# EAGLE design 01 (EAGLE 8.3.2)
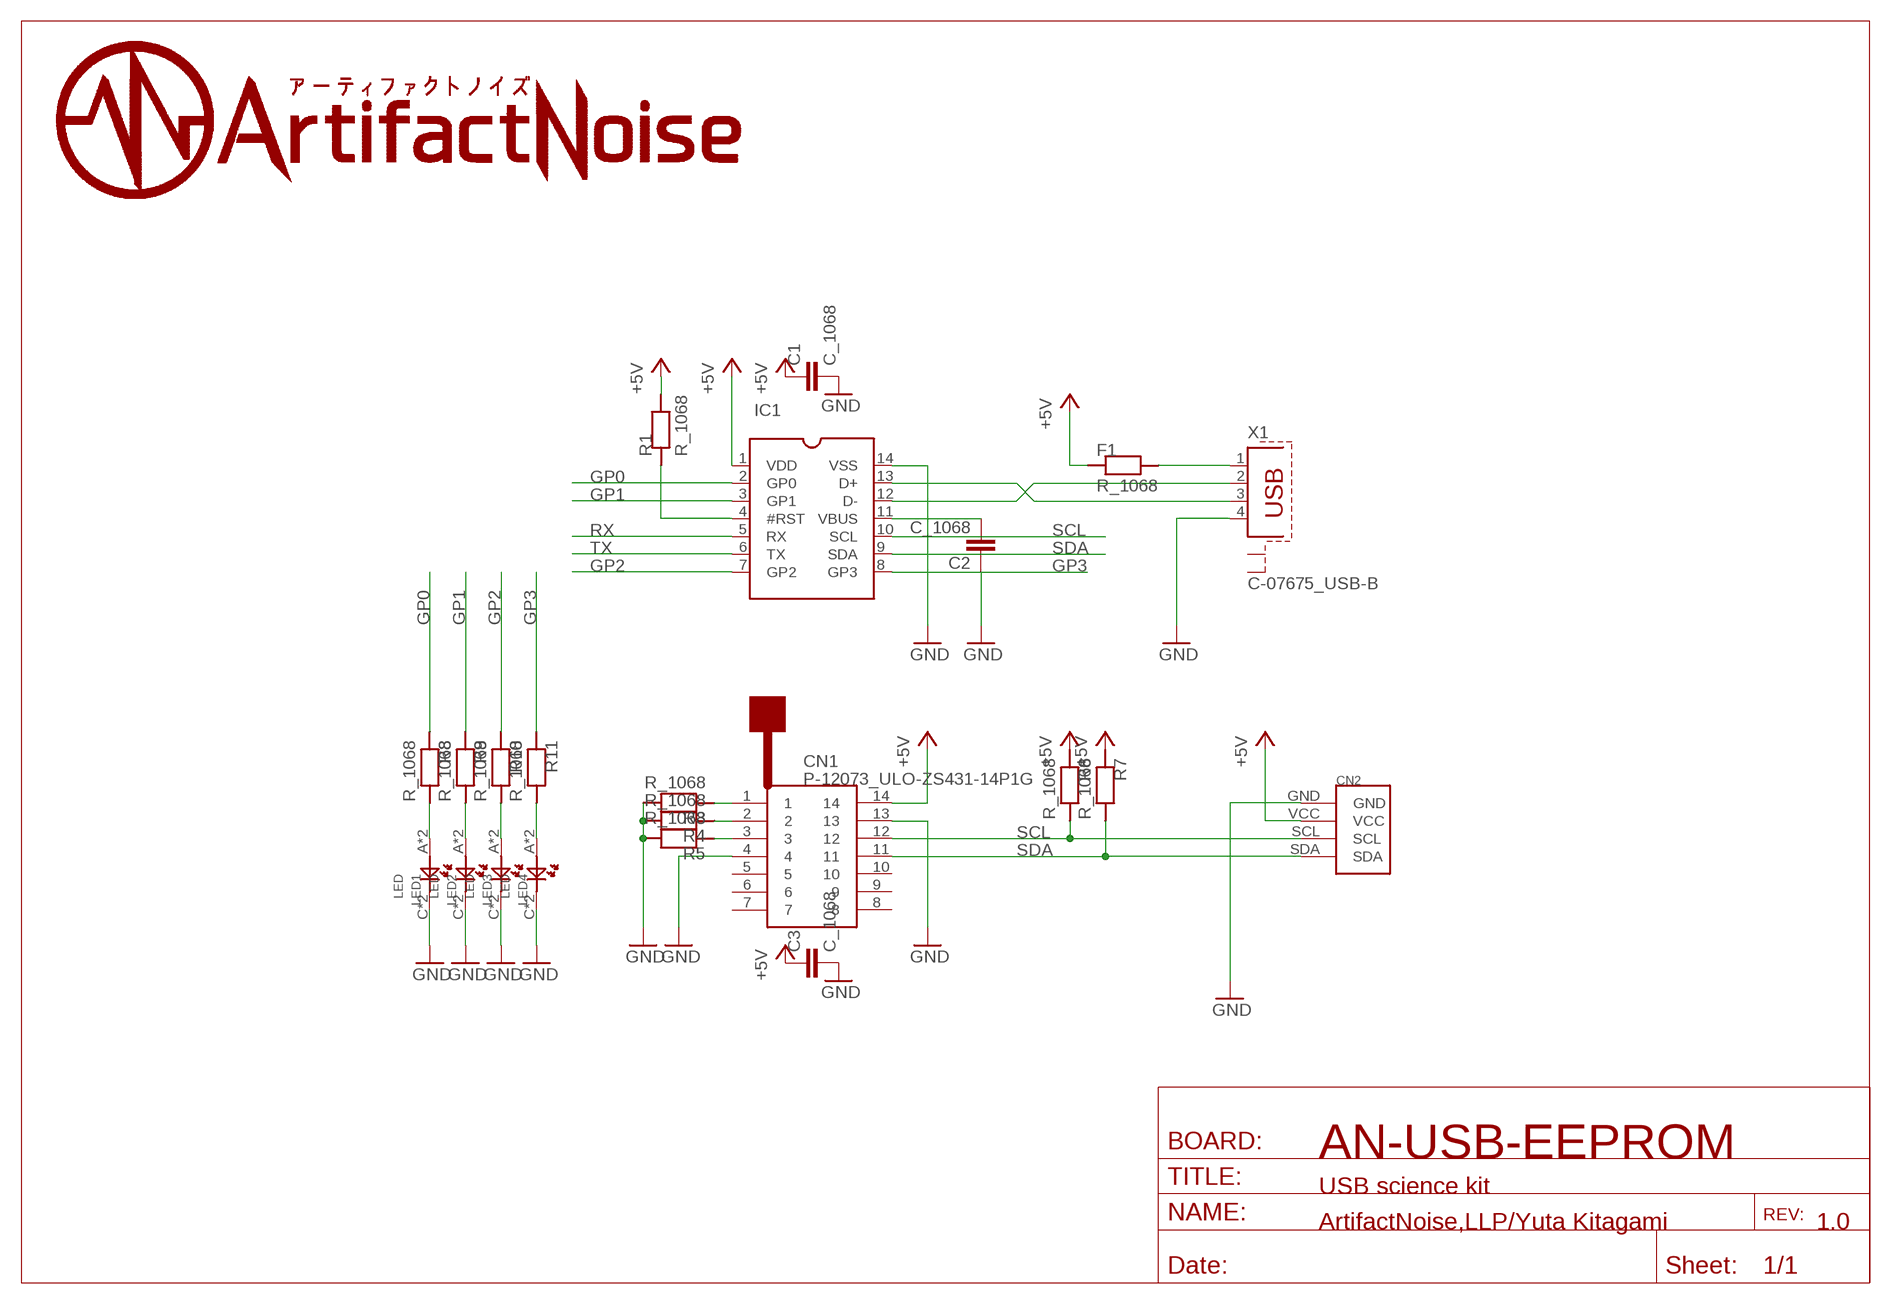
[diagram p0: schematic, sheet 1]

## Parts
C1  C_1068  [C0603]
C2  C_1068  [C0603]
C3  C_1068  [C0603]
CN1  P-12073_ULO-ZS431-14P1G  [ULO-ZS431-14P1G]
CN2  PIN4  [PIN4]
F1  R_1068  [R0603]
IC1  _MCP2221A-I/PS  [SOCKET-14]
LED1  LED  [CHIPLED_0805]
LED2  LED  [CHIPLED_0805]
LED3  LED  [CHIPLED_0805]
LED4  LED  [CHIPLED_0805]
R1  R_1068  [R0603]
R3  R_1068  [R0603]
R4  R_1068  [R0603]
R5  R_1068  [R0603]
R6  R_1068  [R0603]
R7  R_1068  [R0603]
R8  R_1068  [R0603]
R9  R_1068  [R0603]
R10  R_1068  [R0603]
R11  R_1068  [R0603]
X1  C-07675_USB-B  [PN61729-S]

## Nets
+5V: C1.1 C1.D1 C3.1 C3.D1 CN1.14 CN2.VCC F1.1 F1.D1 IC1.1(VDD) R1.2 R1.D2 R6.1 R6.D1 R7.1 R7.D1
GND: C1.2 C1.D2 C2.1 C2.D1 C3.2 C3.D2 CN1.4 CN1.13 CN2.GND IC1.14(VSS) LED1.C LED1.DC(C) LED2.C LED2.DC(C) LED3.C LED3.DC(C) LED4.C LED4.DC(C) R3.2 R3.D2 R4.2 R4.D2 R5.2 R5.D2 X1.4
GP0: IC1.2(GP0) R8.1 R8.D1
GP1: IC1.3(GP1) R9.1 R9.D1
GP2: IC1.7(GP2) R10.1 R10.D1
GP3: IC1.8(GP3) R11.1 R11.D1
N$1: IC1.4(#RST) R1.1 R1.D1
N$2: IC1.13(D+) X1.3
N$3: IC1.12(D-) X1.2
N$4: C2.2 C2.D2 IC1.11(VBUS)
N$5: F1.2 F1.D2 X1.1
N$6: CN1.1 R3.1 R3.D1
N$7: CN1.2 R4.1 R4.D1
N$8: CN1.3 R5.1 R5.D1
N$9: LED1.A LED1.DA(A) R8.2 R8.D2
N$10: LED2.A LED2.DA(A) R9.2 R9.D2
N$11: LED3.A LED3.DA(A) R10.2 R10.D2
N$12: LED4.A LED4.DA(A) R11.2 R11.D2
RX: IC1.5(RX)
SCL: CN1.12 CN2.SCL IC1.10(SCL) R6.2 R6.D2
SDA: CN1.11 CN2.SDA IC1.9(SDA) R7.2 R7.D2
TX: IC1.6(TX)
Unconnected: CN1.5 CN1.6 CN1.7 CN1.8 CN1.9 CN1.10 X1.S1 X1.S2

## Notes on the sheet
- AN-USB-EEPROM
- USB science kit
- ArtifactNoise,LLP/Yuta Kitagami | 1.0

## Library data of the parts
C1-C3 = 01:C_1068
CN1 = 01:P-12073_ULO-ZS431-14P1G
CN2 = 01:PIN4
F1 R1 R3-R11 = 01:R_1068
IC1 = 01:_MCP2221A-I/P: Dual In Line / Socket
LED1-LED4 = 01:LED
X1 = 01:C-07675_USB-B: BERG USB connector; OC_FARNELL: unknown; OC_NEWARK: unknown

## Board
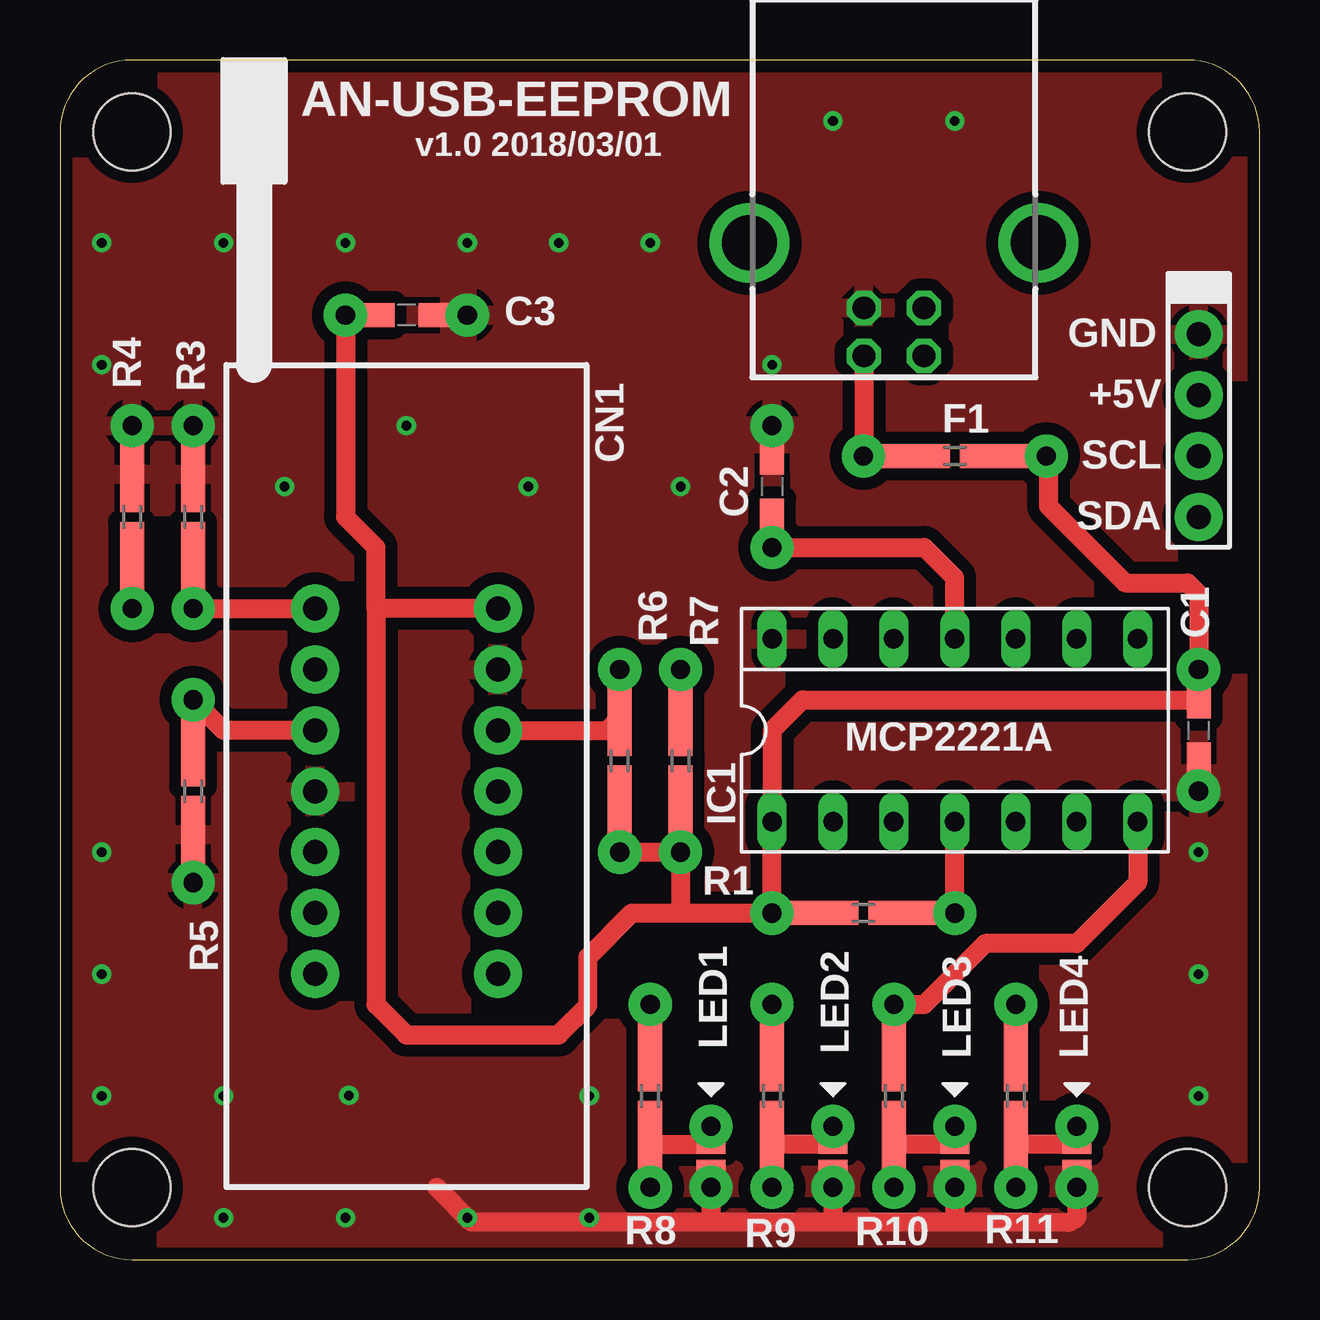
[diagram p1: board, top side]
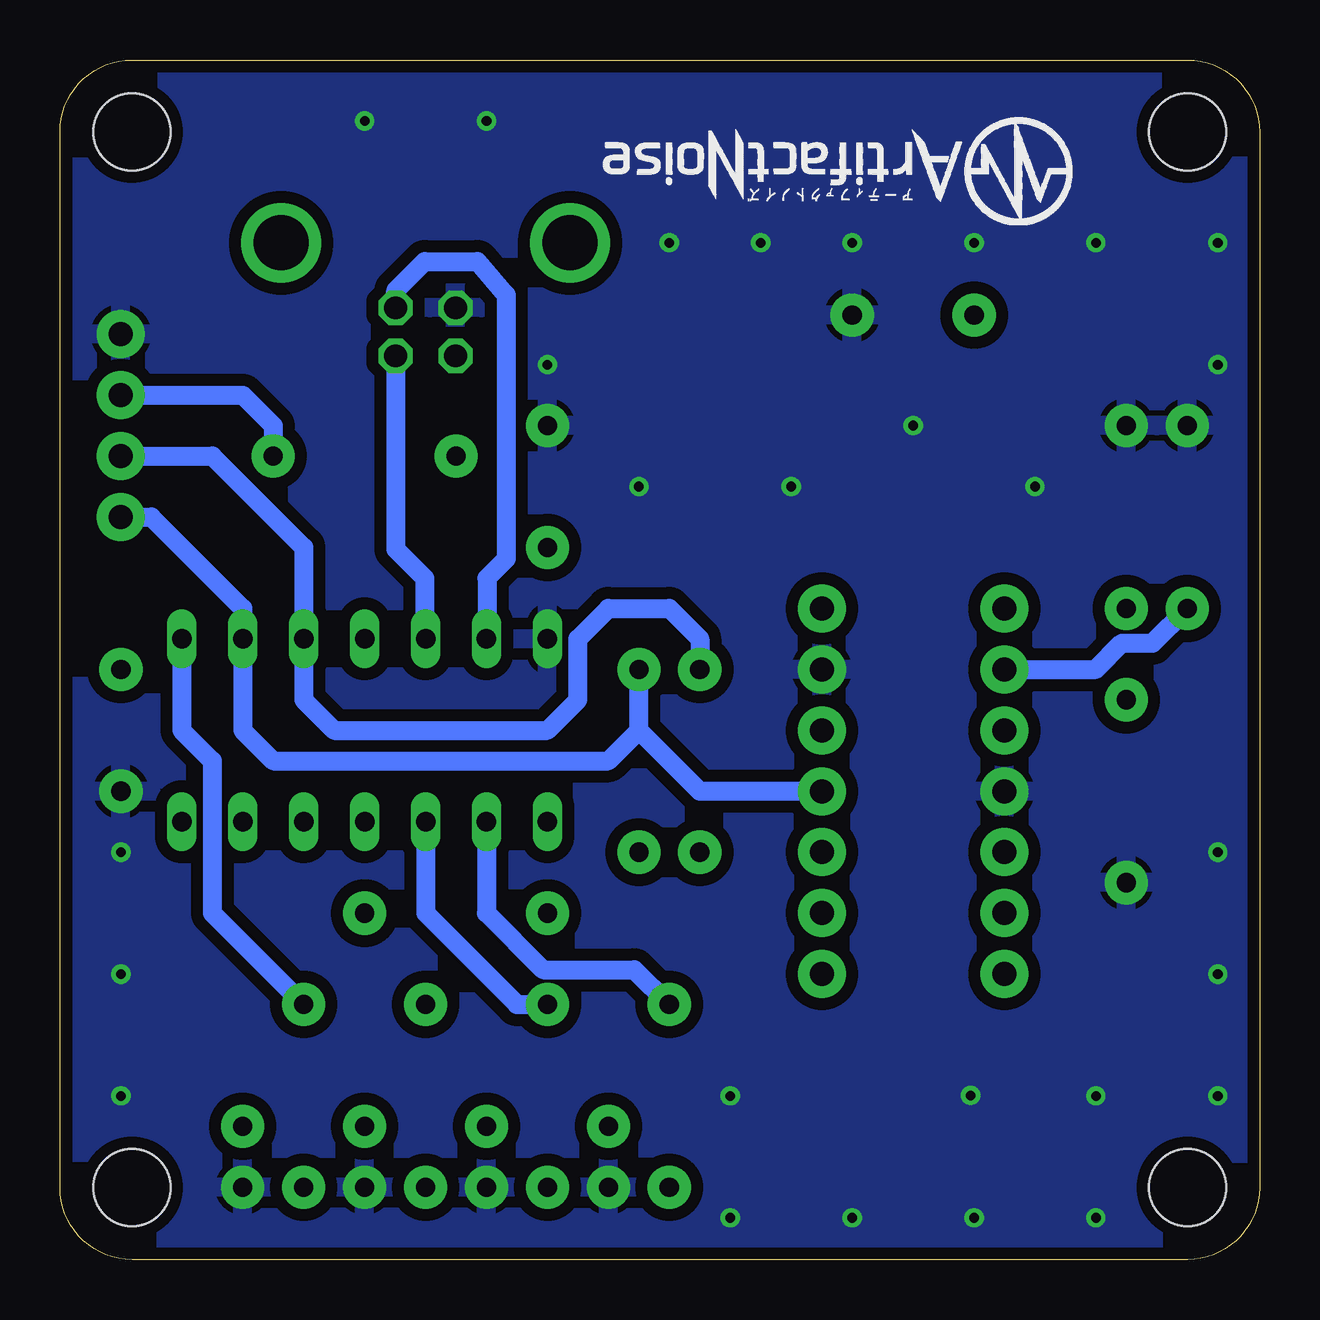
[diagram p2: board, bottom side, seen from below]

Size 50 x 50 mm. Coordinates in mm from the lower left corner, seen from the top.
Outline: 50,3 50,47 arc90 47,50 3,50 arc90 0,47 0,3 arc90 3,0 47,0 arc90 50,3
Copper layers (1*16): Top 0.035mm / dielectric 1.6mm / Bottom 0.035mm
Design rules "Elecrow_2-layer_PCB_eagle_rule": minimum track width 6mil, minimum drill 12mil, track to track 6mil, track to pad 6mil, pad to pad 6mil, via to via 8mil, smd to smd 0mil, copper to edge 20mil, drill to drill 10mil, minimum pad ring 6mil, minimum via ring 6mil, stop-mask expansion 0mil, vias tented up to drill 100mil, thermal gap 10mil
Holes 3.2 mm at 47,47 3,47 3,3 47,3

### Footprints (pad centres in the part's own frame; a part is rotated, then mirrored left to right if it is on the bottom)
C0603 = smd 2.6 x 1: 1 -1.8,0; 2 1.8,0 | drill 0.8 pad 1.8: D1 -2.54,0; D2 2.54,0
ULO-ZS431-14P1G = drill 1 pad 2: 1 -3.81,7.62; 2 -3.81,5.08; 3 -3.81,2.54; 4 -3.81,0; 5 -3.81,-2.54; 6 -3.81,-5.08; 7 -3.81,-7.62; 8 3.81,-7.62; 9 3.81,-5.08; 10 3.81,-2.54; 11 3.81,0; 12 3.81,2.54; 13 3.81,5.08; 14 3.81,7.62
PIN4 = drill 1 pad 2: GND 0,-3.81; SCL 0,1.27; SDA 0,3.81; VCC 0,-1.27
R0603 = smd 3.2 x 1: 1 -1.8,0; 2 1.8,0 | drill 0.8 pad 1.8: D1 -3.81,0; D2 3.81,0
SOCKET-14 = drill 0.813 long: 1 -7.62,-3.81; 2 -5.08,-3.81; 3 -2.54,-3.81; 4 0,-3.81; 5 2.54,-3.81; 6 5.08,-3.81; 7 7.62,-3.81; 8 7.62,3.81; 9 5.08,3.81; 10 2.54,3.81; 11 0,3.81; 12 -2.54,3.81; 13 -5.08,3.81; 14 -7.62,3.81
CHIPLED_0805 = smd 1.2 x 0.8: A 0,-1.8; C 0,-0.74 | drill 0.8 pad 1.8: DA 0,-2.54; DC 0,0
PN61729-S = drill 0.95 octagon: 1 1.25,4.71; 2 -1.25,4.71; 3 -1.25,2.71; 4 1.25,2.71 | drill 2.3 pad 2.9: S1 -6.02,0; S2 6.02,0

### Placement (x,y rotation side)
C1  47.46,22.06 270 top
C2  29.68,32.22 270 top
C3  14.44,39.37 0 top
CN1  14.44,19.52 0 top
CN2  47.46,34.76 180 top
F1  37.3,33.49 180 top
IC1  37.3,22.06 0 top
LED1  27.14,3.01 180 top
LED2  32.22,3.01 180 top
LED3  37.3,3.01 180 top
LED4  42.38,3.01 180 top
R1  33.49,14.44 180 top
R3  5.55,30.95 90 top
R4  3.01,30.95 90 top
R5  5.55,19.52 270 top
R6  23.33,20.79 90 top
R7  25.87,20.79 90 top
R8  24.6,6.82 270 top
R9  29.68,6.82 270 top
R10  34.76,6.82 270 top
R11  39.84,6.82 270 top
U$1  [AN-LOGO2]  7.8,47.6 180 bottom
X1  34.76,42.38 180 top

### Tracks (layer width: path | path; a pad name or v marks a point on that pad's centre or on a via)
+5V
  Top 0.8: C1.D1 47.46,23.33 30.95,23.33 29.68,22.06 IC1.1 R1.D2 R1.2 25.87,14.44 | R7.D1 R6.D1 R6.1 | R7.1 R7.D1 | 25.87,14.44 23.84,14.44 22,12.6 22,10.6 20.8,9.4 20.79,9.36 14.44,9.36 13.17,10.63 13.17,27.14 | F1.1 F1.D1 41.2,33.4 41.2,31.4 44.4,28.2 47,28.2 47.46,27.74 C1.D1 | 13.17,27.14 13.17,29.68 11.9,30.95 C3.D1 C3.1 | CN1.14 13.17,27.14 | R7.D1 25.87,14.44 | C1.1 C1.D1
  Bottom 0.8: CN2.VCC 42.38,36.03 41.11,34.76 F1.D1
GND  (via drill 0.4 pad 0.8)
  Top 0.8: LED4.DC 41.89,3.01 | 32.22,1.56 27.14,1.56 | 37.3,1.56 32.22,1.56 | 37.3,1.56 40.44,1.56 42.02,1.54 42.38,1.74 LED4.DC | 27.14,1.56 LED1.DC LED1.C | 32.22,1.56 LED2.DC LED2.C | 37.3,1.56 LED3.DC LED3.C | 15.71,3.01 17.16,1.56 27.14,1.56 | LED4.C LED4.DC
  other vias: 37.3,47.46 32.22,47.46 24.6,42.38 20.79,42.38 16.98,42.38 19.52,32.22 9.36,32.22 1.74,42.38 1.74,37.3 1.74,16.98 1.74,11.9 1.74,6.82 6.82,1.74 11.9,1.74 16.98,1.74 22.06,1.74 47.46,6.82 47.46,11.9 47.46,16.98 14.44,34.76 12.04,6.84 11.9,42.38 25.87,32.22 29.68,37.3 6.82,6.82 6.82,42.38 22.06,6.82
  pour Top (isolate 0.5): 51.27,-0.8 -0.8,-0.8 -0.8,51.27 51.27,51.27
  pour Bottom (isolate 0.5): 51.27,-0.8 -0.8,-0.8 -0.8,51.27 51.27,51.27
GP0
  Top 0.8: R8.1 R8.D1
  Bottom 0.8: IC1.2 32.22,14.44 29.86,12.08 26.05,12.08 R8.D1
GP1
  Top 0.8: R9.1 R9.D1
  Bottom 0.8: IC1.3 34.76,14.44 30.95,10.63 R9.D1
GP2
  Top 0.8: IC1.7 44.92,15.71 42.38,13.17 38.57,13.17 36.03,10.63 R10.D1 R10.1
GP3
  Top 0.8: R11.1 R11.D1
  Bottom 0.8: IC1.8 44.92,22.06 43.65,20.79 43.65,14.44 R11.D1
N$1
  Top 0.8: IC1.4 R1.D1 R1.1
N$2
  Bottom 0.8: X1.3 36.01,40.39 34.8,41.6 32.6,41.6 31.4,40.2 31.4,29.2 32.2,28.4 32.2,25.89 IC1.13
N$3
  Bottom 0.8: X1.2 36.01,29.61 34.8,28.4 34.8,25.91 IC1.12
N$4
  Top 0.8: IC1.11 37.3,28.41 36.03,29.68 C2.D2 C2.2
N$5
  Top 0.8: X1.1 33.51,33.51 F1.D2 F1.2
N$6
  Top 0.8: CN1.1 R3.D1 R3.1
N$7
  Top 0.8: R4.1 R4.D1
  Bottom 0.8: CN1.2 6.82,24.6 5.73,25.69 4.46,25.69 R4.D1
N$8
  Top 0.8: CN1.3 6.82,22.06 R5.D1 R5.1
N$9
  Top 0.8: LED1.DA LED1.A 24.81,4.81 | 24.81,4.81 R8.2 | R8.D2 24.6,4.6 24.81,4.81
N$10
  Top 0.8: LED2.DA LED2.A 29.89,4.81 R9.2 R9.D2
N$11
  Top 0.8: LED3.DA LED3.A 34.97,4.81 R10.2 R10.D2
N$12
  Top 0.8: LED4.DA LED4.A 40.05,4.81 R11.2 R11.D2
SCL
  Top 0.8: CN1.12 22.8,22.06 R6.2 R6.D2
  Bottom 0.8: R6.D2 23.33,25.87 24.6,27.14 27.14,27.14 28.41,25.87 28.41,23.33 29.68,22.06 38.57,22.06 39.84,23.33 IC1.10 39.84,29.68 43.65,33.49 CN2.SCL
SDA
  Top 0.8: R7.D2 R7.2
  Bottom 0.8: 25.87,22.06 27.14,20.79 41.11,20.79 42.38,22.06 IC1.9 42.38,27.14 46.19,30.95 CN2.SDA | 25.87,22.06 R7.D2 | CN1.11 23.33,19.52 25.87,22.06

### Text on the board
tPlace: AN-USB-EEPROM | v1.0 2018/03/01 | GND | +5V | SCL | SDA | MCP2221A